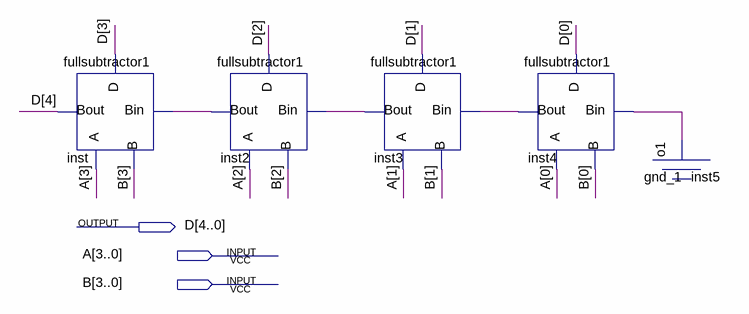
[diagram p0: schematic sheet]
// Quartus schematic FS4.bdf as structural Verilog: 5 symbols, 3 pins
module FS4 (
  input  [3:0] A,
  input  [3:0] B,
  output [4:0] D
);

  wire inst2_bout, inst3_bout, inst4_bout, inst5_o1;

  fullsubtractor1 inst (.A(A[3]), .B(B[3]), .Bin(inst2_bout), .Bout(D[4]), .D(D[3]));
  fullsubtractor1 inst2 (.A(A[2]), .B(B[2]), .Bin(inst3_bout), .Bout(inst2_bout), .D(D[2]));
  fullsubtractor1 inst3 (.A(A[1]), .B(B[1]), .Bin(inst4_bout), .Bout(inst3_bout), .D(D[1]));
  fullsubtractor1 inst4 (.A(A[0]), .B(B[0]), .Bin(inst5_o1), .Bout(inst4_bout), .D(D[0]));
  gnd_1 inst5 (.o1(inst5_o1));
endmodule
